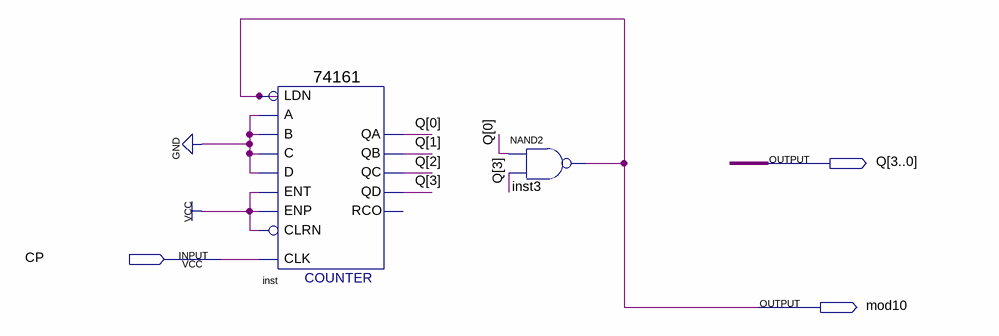
[diagram p0: schematic sheet]
// Quartus schematic mod10.bdf as structural Verilog: 2 symbols, 3 pins
module mod10 (
  input  CP,
  output [3:0] Q,
  output mod10
);

  \74161  inst (
    .CLRN(1'b1), .CLK(CP), .ENP(1'b1), .LDN(mod10), .A(1'b0), .D(1'b0), .ENT(1'b1), .B(1'b0), .C(1'b0),
    .QD(Q[3]), .QC(Q[2]), .QB(Q[1]), .QA(Q[0]));  // open: RCO
  nand inst3 (mod10, Q[0], Q[3]);
endmodule
